# Altium schematic sheet Schematic.SchDoc
size A4; SheetNumber: 1; SheetTotal: 1
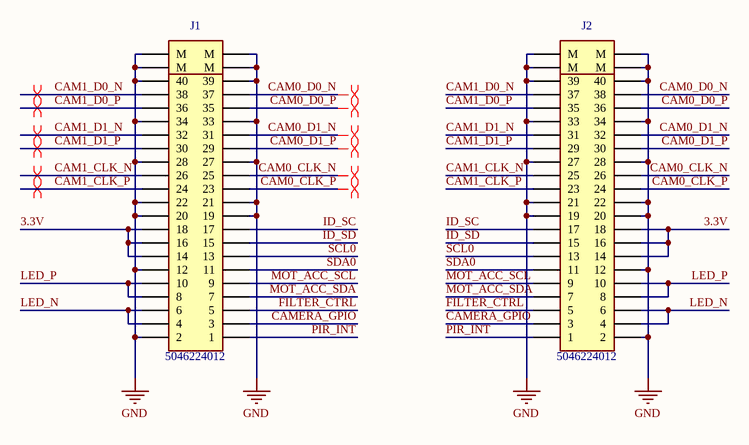
[diagram p0: Schematic.SchDoc]

## Parts
J1  5046224012  [MOLEX 5046224012]
J2  5046224012  [MOLEX 5046224012]

## Nets
GND: J1.2 J1.12 J1.19 J1.20 J1.21 J1.22 J1.27 J1.28 J1.33 J1.34 J1.39 J1.40 J1.MNT1(M) J1.MNT2(M) J1.MNT3(M) J1.MNT4(M) J2.2 J2.12 J2.19 J2.20 J2.21 J2.22 J2.27 J2.28 J2.33 J2.34 J2.39 J2.40 J2.MNT1(M) J2.MNT2(M) J2.MNT3(M) J2.MNT4(M)
3.3V: J1.14 J1.16 J1.18 J2.14 J2.16 J2.18
CAM0_CLK_N: J1.25 J2.26
CAM0_CLK_P: J1.23 J2.24
CAM0_D0_N: J1.37 J2.38
CAM0_D0_P: J1.35 J2.36
CAM0_D1_N: J1.31 J2.32
CAM0_D1_P: J1.29 J2.30
CAM1_CLK_N: J1.26 J2.25
CAM1_CLK_P: J1.24 J2.23
CAM1_D0_N: J1.38 J2.37
CAM1_D0_P: J1.36 J2.35
CAM1_D1_N: J1.32 J2.31
CAM1_D1_P: J1.30 J2.29
CAMERA_GPIO: J1.3 J2.3
FILTER_CTRL: J1.5 J2.5
ID_SC: J1.17 J2.17
ID_SD: J1.15 J2.15
LED_N: J1.4 J1.6 J2.4 J2.6
LED_P: J1.8 J1.10 J2.8 J2.10
MOT_ACC_SCL: J1.9 J2.9
MOT_ACC_SDA: J1.7 J2.7
PIR_INT: J1.1 J2.1
SCL0: J1.13 J2.13
SDA0: J1.11 J2.11

## Layout directives
differential pair; differential pair class 100OHM_DIFF: CAM0_CLK_N, CAM0_CLK_P, CAM0_D0_N, CAM0_D0_P, CAM0_D1_N, CAM0_D1_P, CAM1_CLK_N, CAM1_CLK_P, CAM1_D0_N, CAM1_D0_P, CAM1_D1_N, CAM1_D1_P

## Notes on the sheet
- Version:
- SVN Rev:
- Sheet:
- File:
- Modification Date:
- Variant:
- of
- Sheet Size:
- A4
- SaraAI

## Library data of the parts
J1 J2 = 511: SMT 2x20 0.35mm Straight 50V 0.3A; 03 Manufacturer: Molex; 00 Index: 511; 01 Name: CONNECTOR PCB 5046224012 Molex; 04 Main Group: CONNECTOR; 05 Sub Group: PCB; 06 Assembly: SMT; 13 Parameter 6: 0.3A; 14 Modification Date: 09.03.2021; ComponentLink1Description: DATASHEET; ComponentLink1URL: https://www.molex.com/molex/products/part-detail/pcb_headers/5046224012; 09 Parameter 2: 0.35mm; 08 Parameter 1: 2x20; 11 Parameter 4: Straight; 12 Parameter 5: 50V; 07 Package: *; 02 MPN: 5046224012